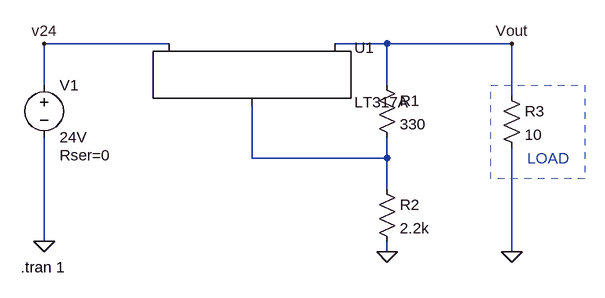
[diagram p0: schematic PS_LM317.asc]
PS_LM317.asc, the LTspice schematic file:
Version 4
SHEET 1 5460 1232
WIRE 2272 112 2080 112
WIRE 2608 112 2528 112
WIRE 2800 112 2608 112
WIRE 2080 176 2080 112
WIRE 2608 176 2608 112
WIRE 2800 192 2800 112
WIRE 2400 288 2400 208
WIRE 2608 288 2608 256
WIRE 2608 288 2400 288
WIRE 2608 336 2608 288
WIRE 2080 416 2080 256
WIRE 2608 432 2608 416
WIRE 2800 432 2800 272
FLAG 2080 416 0
FLAG 2800 432 0
FLAG 2080 112 v24
FLAG 2608 432 0
FLAG 2800 112 Vout
SYMBOL voltage 2080 160 R0
WINDOW 123 0 0 Left 0
WINDOW 39 24 124 Left 2
SYMATTR SpiceLine Rser=0
SYMATTR InstName V1
SYMATTR Value 24V
SYMBOL PowerProducts\\LT317A 2400 112 R0
SYMATTR InstName U1
SYMBOL res 2784 176 R0
SYMATTR InstName R3
SYMATTR Value 10
SYMBOL res 2592 160 R0
SYMATTR InstName R1
SYMATTR Value 330
SYMBOL res 2592 320 R0
SYMATTR InstName R2
SYMATTR Value 2.2k
TEXT 2824 288 Left 2 ;LOAD
TEXT 2044 456 Left 2 !.tran 1
RECTANGLE Normal 2912 320 2768 176 2

The netlist it stands for:
* PS_LM317.asc
V1 v24 0 24V Rser=0
XU1 N001 Vout v24 LT317A
R3 Vout 0 10
R1 Vout N001 330
R2 N001 0 2.2k
* LOAD
.tran 1
.lib LTC.lib
.backanno
.end